# EAGLE design encoder (EAGLE 7.2.0)
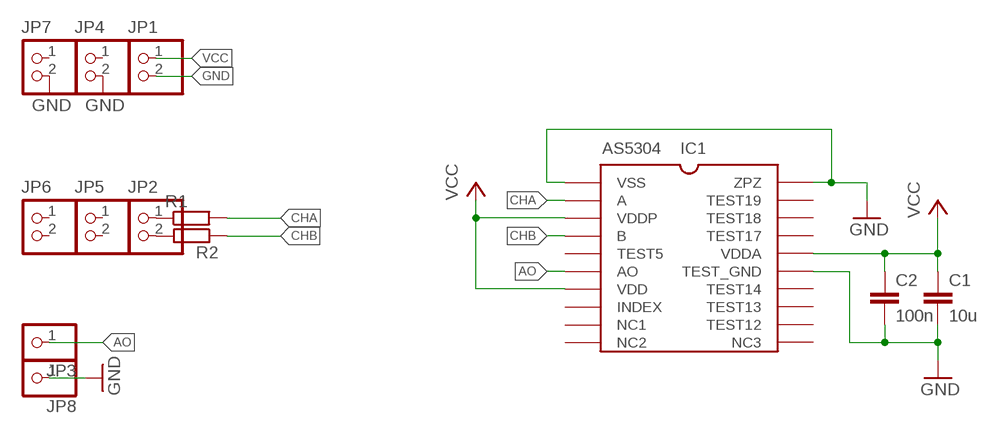
[diagram p0: schematic, sheet 1]

## Parts
C1  10u  C-EUC0603  [C0603]
C2  100n  C-EUC0603  [C0603]
IC1  AS5304  [TSSOP20]
JP1  PINHD_1X2_ROUND  [PINHD_1X2_ROUND]
JP2  PINHD_1X2_ROUND  [PINHD_1X2_ROUND]
JP3  PINHD-1X1  [1X01]
JP4  PINHD_1X2_ROUND  [PINHD_1X2_ROUND]
JP5  PINHD_1X2_ROUND  [PINHD_1X2_ROUND]
JP6  PINHD_1X2_ROUND  [PINHD_1X2_ROUND]
JP7  PINHD_1X2_ROUND  [PINHD_1X2_ROUND]
JP8  PINHD-1X1  [1X01]
R1  R-EU_R0805  [R0805]
R2  R-EU_R0805  [R0805]

## Nets
AO: IC1.AO JP3.1
CHA: IC1.A R1.2
CHB: IC1.B R2.1
GND: C1.2 C2.2 IC1.TEST_GND IC1.VSS IC1.ZPZ JP1.2 JP4.2 JP7.2 JP8.1
N$1: JP2.1 R1.1
N$2: JP2.2 R2.2
VCC: C1.1 C2.1 IC1.VDD IC1.VDDA IC1.VDDP JP1.1
Unconnected: IC1.INDEX IC1.NC1(NC2) IC1.NC2(NC3) IC1.NC(NC1) IC1.TEST1(TEST12) IC1.TEST2(TEST13) IC1.TEST3(TEST14) IC1.TEST4(TEST17) IC1.TEST5(TEST18) IC1.TEST6(TEST19) IC1.TEST(TEST5) JP4.1 JP5.1 JP5.2 JP6.1 JP6.2 JP7.1

## Library data of the parts
C1 C2 = rcl:C-EU: CAPACITOR, European symbol
IC1 = _microMouse:AS5304
JP1 JP2 JP4-JP7 = _microMouse:PINHD_1X2_ROUND
JP3 JP8 = pinhead:PINHD-1X1: PIN HEADER
R1 R2 = rcl:R-EU_: RESISTOR, European symbol

## Board
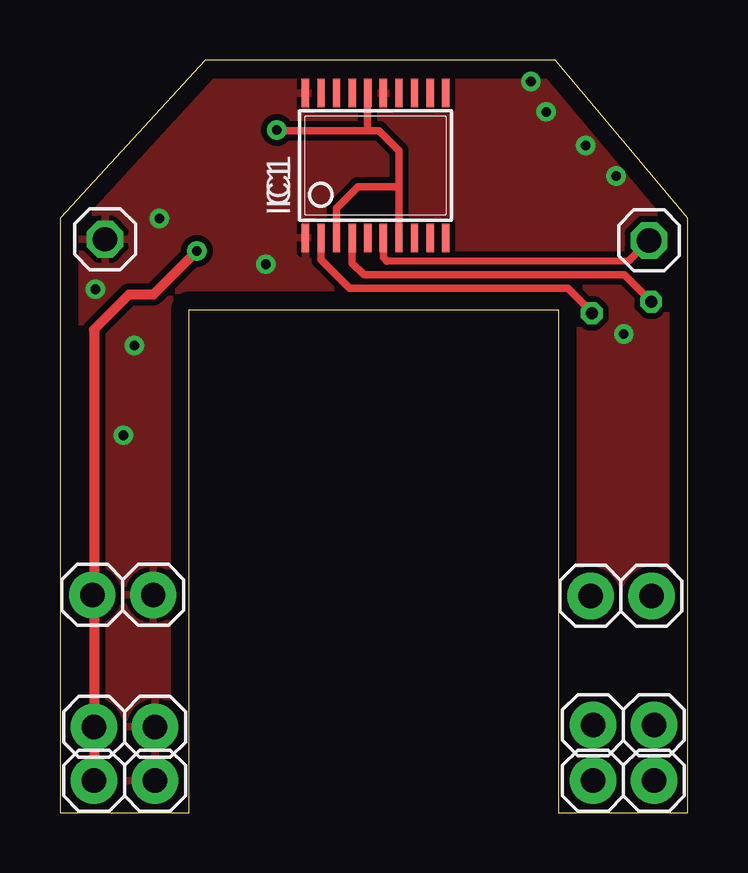
[diagram p1: board, top side]
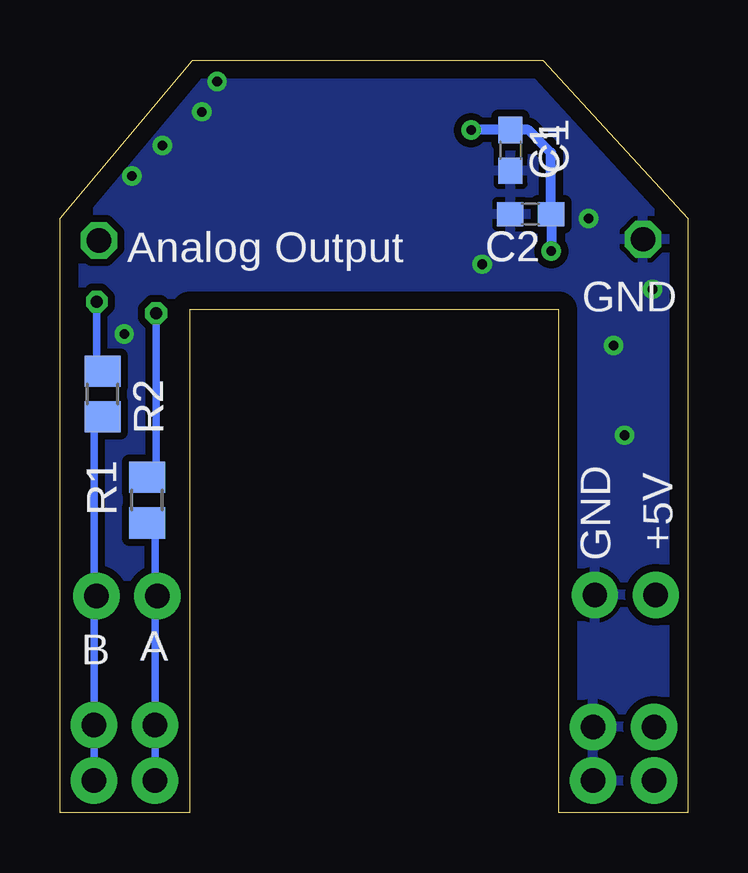
[diagram p2: board, bottom side, seen from below]

Size 26.19 x 31.37 mm. Coordinates in mm from the lower left corner, seen from the top.
Outline: 0,0 5.39,0 5.39,20.95 20.78,20.95 20.78,0 26.19,0 26.19,24.77 20.65,31.37 6.05,31.37 0,24.77 0,0
Copper layers (1*16): Top 0.035mm / dielectric 1.5mm / Bottom 0.035mm
Design rules "default *": minimum track width 10mil, minimum drill 24mil, track to track 8mil, track to pad 8mil, pad to pad 8mil, via to via 8mil, smd to smd 8mil, copper to edge 30mil, drill to drill 8mil, minimum pad ring 10mil, minimum via ring 8mil, stop-mask expansion 4mil, vias tented up to drill 0mil, thermal gap 8mil

### Footprints (pad centres in the part's own frame; a part is rotated, then mirrored left to right if it is on the bottom)
C0603 = smd 1.1 x 1: 1 -0.85,0; 2 0.85,0
TSSOP20 = smd 0.305 x 1.194: A -2.275,-3.019; AO 0.325,-3.019; B -0.975,-3.019; INDEX 1.625,-3.019; NC 2.275,-3.019; NC1 2.925,-3.019; NC2 2.925,3.019; TEST -0.325,-3.019; TEST1 2.275,3.019; TEST2 1.625,3.019; TEST3 0.975,3.019; TEST4 -0.975,3.019; TEST5 -1.625,3.019; TEST6 -2.275,3.019; TEST_GND 0.325,3.019; VDD 0.975,-3.019; VDDA -0.325,3.019; VDDP -1.625,-3.019; VSS -2.925,-3.019; ZPZ -2.925,3.019
PINHD_1X2_ROUND = drill 1.016 pad 1.93: 1 -2.54,0; 2 0,0
1X01 = drill 1.016 octagon: 1 0,0
R0805 = smd 1.3 x 1.5: 1 -0.95,0; 2 0.95,0

### Placement (x,y rotation side)
C1  7.41,27.6 270 bottom
C2  6.56,24.95 180 bottom
IC1  13.16,26.97 0 top
JP1  3.96,1.35 0 top
JP2  24.77,1.35 0 top
JP3  24.56,23.85 0 top
JP4  3.89,9.08 0 top
JP5  24.66,9.04 0 top
JP6  24.77,3.66 0 top
JP7  3.96,3.58 0 top
JP8  1.88,23.9 0 top
R1  22.56,13.03 90 bottom
R2  24.41,17.45 270 bottom

### Tracks (layer width: path | path; a pad name or v marks a point on that pad's centre or on a via)
AO
  Top 0.305: 13.48,23.7 IC1.AO 13.48,23.14 13.64,22.99 23.72,23.01 JP3.1
CHA  (via drill 0.5)
  Top 0.305: IC1.A 10.88,24.36 10.88,23.04 12.07,21.86 21.18,21.86 22.17,20.87 v22.17,20.82
  Bottom 0.254: v22.17,20.82 22.23,20.82
  Bottom 0.305: 22.17,20.77 22.23,20.82 | v22.17,20.82 22.17,20.77 | 22.17,20.77 22.17,14.44 R1.2
CHB  (via drill 0.5)
  Top 0.305: 12.19,24.35 IC1.B 12.18,22.91 12.67,22.42 23.53,22.42 v24.65,21.3 24.77,21.18
  Bottom 0.305: 24.71,21.23 v24.65,21.3 24.65,18.34 R2.1
GND  (via drill 0.4)
  other vias: 1.47,21.82 4.14,24.77 8.59,22.86 21.92,27.81 23.19,26.54 19.63,30.48 20.27,29.21 23.51,19.95 2.64,15.74 3.1,19.47
  pour Top (isolate 0.254): -0.94,33.27 28.52,33.27 28.52,-2.79 -2.97,-2.79 -2.97,33.27
  pour Bottom (isolate 0.305): -2.97,34.04 29.29,34.04 29.29,-3.56 -2.97,-3.56
N$1
  Bottom 0.305: R1.1 22.23,11.98 JP2.1
N$2
  Bottom 0.305: JP2.2 24.77,16.07 R2.2
VCC  (via drill 0.4)
  Top 0.305: 12.83,30.19 IC1.VDDA 12.83,28.42 | IC1.VDD 14.14,24.36 14.14,26.06 | 14.14,26.06 14.14,27.6 13.31,28.42 12.83,28.42 | v9.04,28.45 9.07,28.42 12.83,28.42 | IC1.VDDP 11.53,25.2 12.42,26.09 14.11,26.09 14.14,26.06
  Top 0.406: v5.7,23.41 3.89,21.59 2.87,21.59 1.42,20.14 JP1.1
  Bottom 0.305: v9.04,28.45 | C2.1 5.7,24.94
  Bottom 0.406: v9.04,28.45 C1.1 6.66,28.45 5.72,27.51 C2.1 | 5.7,24.94 v5.7,23.41

### Text on the board
bPlace: +5V | GND | A | B
bNames: Analog Output | GND
_tNames: IC1
_bNames: C1 | C2 | R2 | R1